# Altium schematic sheet LED.SchDoc
size A4
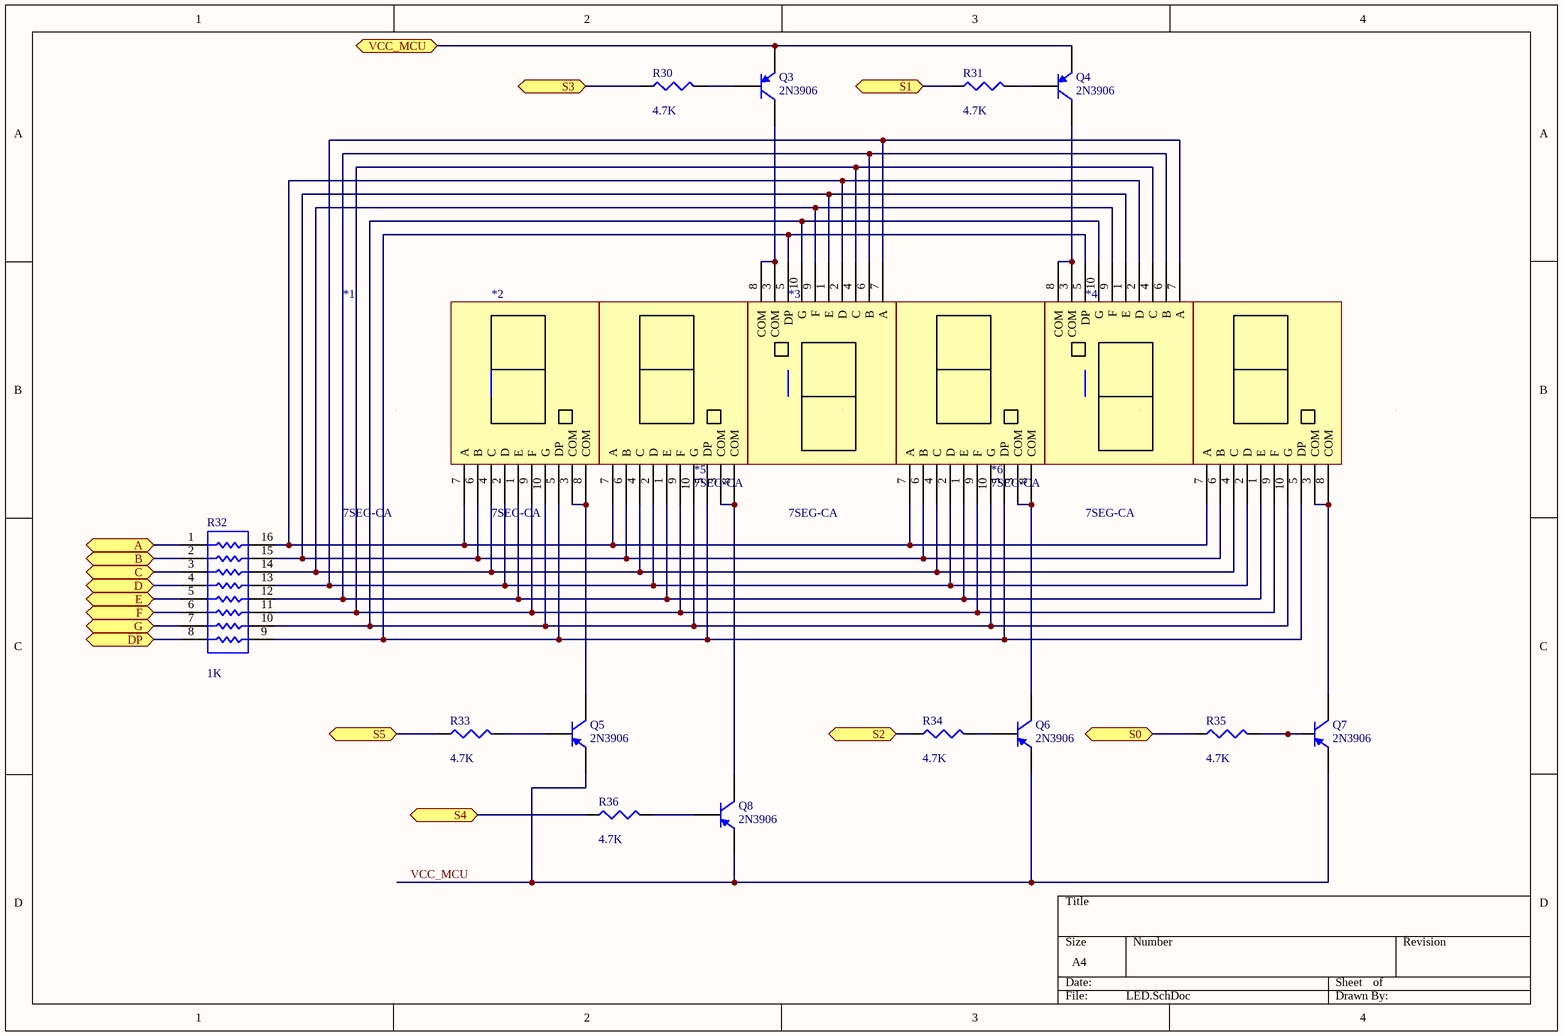
[diagram p0: LED.SchDoc]

## Parts
*1  7SEG-CA  [7SEC-CA-56]
*2  7SEG-CA  [7SEC-CA-56]
*3  7SEG-CA  [7SEC-CA-56]
*4  7SEG-CA  [7SEC-CA-56]
*5  7SEG-CA  [7SEC-CA-56]
*6  7SEG-CA  [7SEC-CA-56]
Q3  2N3906  [SOT-23B_N]
Q4  2N3906  [SOT-23B_N]
Q5  2N3906  [SOT-23B_N]
Q6  2N3906  [SOT-23B_N]
Q7  2N3906  [SOT-23B_N]
Q8  2N3906  [SOT-23B_N]
R30  value 4.7K  [12Z-2010]  (hidden comment: Res3)
R31  value 4.7K  [12Z-2010]  (hidden comment: Res3)
R32  value 1K  [SO-16_N]  (hidden comment: Res Pack3)
R33  value 4.7K  [12Z-2010]  (hidden comment: Res3)
R34  value 4.7K  [12Z-2010]  (hidden comment: Res3)
R35  value 4.7K  [12Z-2010]  (hidden comment: Res3)
R36  value 4.7K  [12Z-2010]  (hidden comment: Res3)

## Ports
A (bidir), B (bidir), C (bidir), D (bidir), DP (bidir), E (bidir), F (bidir), G (bidir), S0 (bidir), S1 (bidir), S2 (bidir), S3 (bidir), S4 (bidir), S5 (bidir), VCC_MCU (bidir)

## Nets
A: R32.1 ; port A
B: R32.2 ; port B
C: R32.3 ; port C
D: R32.4 ; port D
DP: R32.8 ; port DP
E: R32.5 ; port E
F: R32.6 ; port F
G: R32.7 ; port G
S0: R35.1 ; port S0
S1: R31.1 ; port S1
S2: R34.1 ; port S2
S3: R30.1 ; port S3
S4: R36.1 ; port S4
S5: R33.1 ; port S5
VCC_MCU: Q5.3(E) Q6.3(E) Q7.3(E) Q8.3(E)
VCC_MCU: Q3.3(E) Q4.3(E) ; port VCC_MCU  [a separate net that carries the same name]
Net*1_1: *1.1(E) *2.1(E) *3.1(E) *4.1(E) *5.6(B) *6.6(B) R32.12
Net*1_2: *1.2(D) *2.2(D) *3.2(D) *4.2(D) *5.7(A) *6.7(A) R32.13
Net*1_3: *1.3(COM) *1.8(COM) Q5.1(C)
Net*1_4: *1.4(C) *2.4(C) *3.4(C) *4.4(C) *5.9(F) *6.9(F) R32.14
Net*1_5: *1.5(DP) *2.5(DP) *3.5(DP) *4.5(DP) *5.5(DP) *6.5(DP) R32.9
Net*1_6: *1.6(B) *2.6(B) *3.6(B) *4.6(B) *5.1(E) *6.1(E) R32.15
Net*1_7: *1.7(A) *2.7(A) *3.7(A) *4.7(A) *5.2(D) *6.2(D) R32.16
Net*1_9: *1.9(F) *2.9(F) *3.9(F) *4.9(F) *5.4(C) *6.4(C) R32.11
Net*1_10: *1.10(G) *2.10(G) *3.10(G) *4.10(G) *5.10(G) *6.10(G) R32.10
Net*2_3: *2.3(COM) *2.8(COM) Q8.1(C)
Net*3_3: *3.3(COM) *3.8(COM) Q6.1(C)
Net*4_3: *4.3(COM) *4.8(COM) Q7.1(C)
Net*5_3: *5.3(COM) *5.8(COM) Q3.1(C)
Net*6_3: *6.3(COM) *6.8(COM) Q4.1(C)
NetQ3_2: Q3.2(B) R30.2
NetQ4_2: Q4.2(B) R31.2
NetQ5_2: Q5.2(B) R33.2
NetQ6_2: Q6.2(B) R34.2
NetQ7_2: Q7.2(B) R35.2
NetQ8_2: Q8.2(B) R36.2

## Library data of the parts
Q3-Q8 = PNP: PNP Bipolar Transistor; Published: 8-Jun-2000; LatestRevisionDate: 29-May-2009; LatestRevisionNote: IPC-7351 Footprint Added.; PackageVersion: Aug-1999; PackageReference: SOT-23B; Publisher: Altium Limited; PackageDescription: 3-Pin SOT-23 Package 0.95 mm Pitch, 2.4 mm Lead Span
R30 R31 R33-R36 = Res3: Resistor; Published: 8-Jun-2000; LatestRevisionDate: 29-May-2009; LatestRevisionNote: IPC-7351 Footprint Added.; PackageReference: J1-0603; Publisher: Altium Limited; PackageDescription: Chip Resistor
R32 = Res Pack3: Isolated Resistor Network; Published: 24-Mar-1999; LatestRevisionDate: 29-May-2009; LatestRevisionNote: IPC-7351 Footprint Added.; PackageReference: SO-16; Publisher: Altium Limited; PackageDescription: 16-Pin Small Outline Integrated Circuit 1.27 mm Pitch; Code_JEDEC: MS-012-AC; Code_IPC: SOIC127P600-16